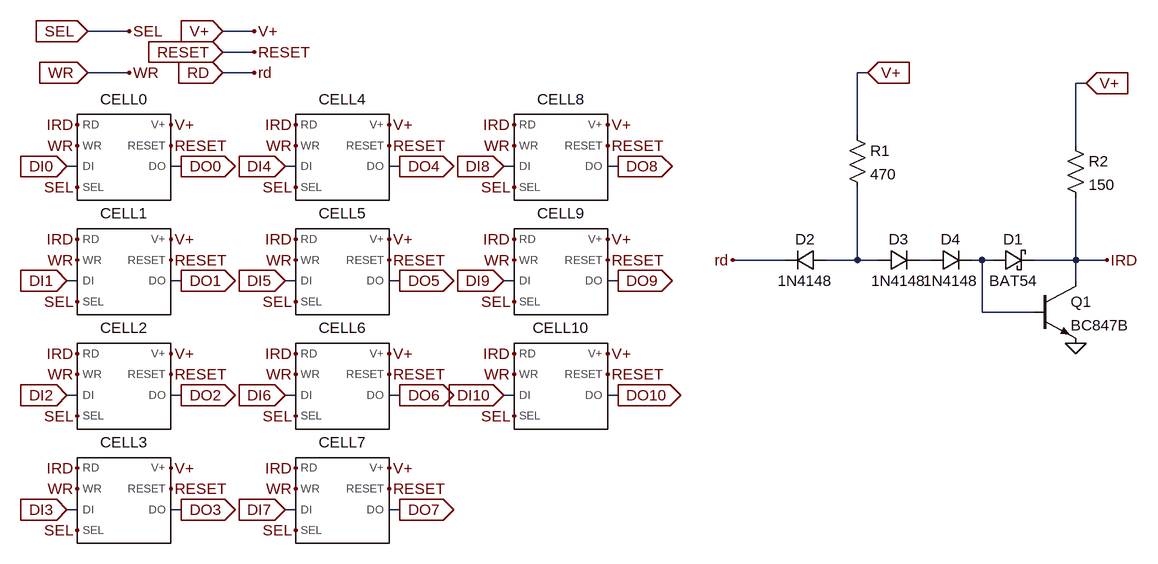
[diagram p0: schematic PMemWord.asc]
PMemWord.asc, the LTspice schematic file:
Version 4
SHEET 1 1744 2248
WIRE 192 80 128 80
WIRE 384 80 336 80
WIRE 384 112 336 112
WIRE 192 144 128 144
WIRE 384 144 336 144
WIRE 1328 144 1312 144
WIRE 1664 160 1648 160
WIRE 1312 240 1312 144
WIRE 1648 256 1648 160
WIRE 112 288 96 288
WIRE 272 288 256 288
WIRE 448 288 432 288
WIRE 608 288 592 288
WIRE 784 288 768 288
WIRE 944 288 928 288
WIRE 1200 432 1120 432
WIRE 1312 432 1312 320
WIRE 1312 432 1264 432
WIRE 1344 432 1312 432
WIRE 1424 432 1408 432
WIRE 1504 432 1488 432
WIRE 1520 432 1504 432
WIRE 1648 432 1648 336
WIRE 1648 432 1584 432
WIRE 1696 432 1648 432
WIRE 112 464 96 464
WIRE 272 464 256 464
WIRE 448 464 432 464
WIRE 608 464 592 464
WIRE 784 464 768 464
WIRE 944 464 928 464
WIRE 1648 464 1648 432
WIRE 1504 512 1504 432
WIRE 1584 512 1504 512
WIRE 112 640 96 640
WIRE 272 640 256 640
WIRE 448 640 432 640
WIRE 608 640 592 640
WIRE 784 640 768 640
WIRE 944 640 928 640
WIRE 112 816 96 816
WIRE 272 816 256 816
WIRE 448 816 432 816
WIRE 608 816 592 816
FLAG 256 224 V+
FLAG 256 256 RESET
FLAG 96 288 DI0
IOPIN 96 288 In
FLAG 272 288 DO0
IOPIN 272 288 Out
FLAG 112 224 IRD
FLAG 112 256 WR
FLAG 112 320 SEL
FLAG 128 80 SEL
IOPIN 128 80 In
FLAG 192 80 SEL
FLAG 336 144 RD
IOPIN 336 144 In
FLAG 128 144 WR
IOPIN 128 144 In
FLAG 192 144 WR
FLAG 336 80 V+
IOPIN 336 80 In
FLAG 384 80 V+
FLAG 336 112 RESET
IOPIN 336 112 In
FLAG 384 112 RESET
FLAG 256 400 V+
FLAG 256 432 RESET
FLAG 96 464 DI1
IOPIN 96 464 In
FLAG 272 464 DO1
IOPIN 272 464 Out
FLAG 112 400 IRD
FLAG 112 432 WR
FLAG 112 496 SEL
FLAG 256 576 V+
FLAG 256 608 RESET
FLAG 96 640 DI2
IOPIN 96 640 In
FLAG 272 640 DO2
IOPIN 272 640 Out
FLAG 112 576 IRD
FLAG 112 608 WR
FLAG 112 672 SEL
FLAG 256 752 V+
FLAG 256 784 RESET
FLAG 96 816 DI3
IOPIN 96 816 In
FLAG 272 816 DO3
IOPIN 272 816 Out
FLAG 112 752 IRD
FLAG 112 784 WR
FLAG 112 848 SEL
FLAG 592 224 V+
FLAG 592 256 RESET
FLAG 432 288 DI4
IOPIN 432 288 In
FLAG 608 288 DO4
IOPIN 608 288 Out
FLAG 448 224 IRD
FLAG 448 256 WR
FLAG 448 320 SEL
FLAG 592 400 V+
FLAG 592 432 RESET
FLAG 432 464 DI5
IOPIN 432 464 In
FLAG 608 464 DO5
IOPIN 608 464 Out
FLAG 448 400 IRD
FLAG 448 432 WR
FLAG 448 496 SEL
FLAG 592 576 V+
FLAG 592 608 RESET
FLAG 432 640 DI6
IOPIN 432 640 In
FLAG 608 640 DO6
IOPIN 608 640 Out
FLAG 448 576 IRD
FLAG 448 608 WR
FLAG 448 672 SEL
FLAG 592 752 V+
FLAG 592 784 RESET
FLAG 432 816 DI7
IOPIN 432 816 In
FLAG 608 816 DO7
IOPIN 608 816 Out
FLAG 448 752 IRD
FLAG 448 784 WR
FLAG 448 848 SEL
FLAG 928 224 V+
FLAG 928 256 RESET
FLAG 768 288 DI8
IOPIN 768 288 In
FLAG 944 288 DO8
IOPIN 944 288 Out
FLAG 784 224 IRD
FLAG 784 256 WR
FLAG 784 320 SEL
FLAG 928 400 V+
FLAG 928 432 RESET
FLAG 768 464 DI9
IOPIN 768 464 In
FLAG 944 464 DO9
IOPIN 944 464 Out
FLAG 784 400 IRD
FLAG 784 432 WR
FLAG 784 496 SEL
FLAG 928 576 V+
FLAG 928 608 RESET
FLAG 768 640 DI10
IOPIN 768 640 In
FLAG 944 640 DO10
IOPIN 944 640 Out
FLAG 784 576 IRD
FLAG 784 608 WR
FLAG 784 672 SEL
FLAG 1648 560 0
FLAG 1328 144 V+
IOPIN 1328 144 In
FLAG 1664 160 V+
IOPIN 1664 160 In
FLAG 1696 432 IRD
FLAG 384 144 rd
FLAG 1120 432 rd
SYMBOL PMemCell 176 272 R0
SYMATTR InstName CELL0
SYMBOL PMemCell 176 448 R0
SYMATTR InstName CELL1
SYMBOL PMemCell 176 624 R0
SYMATTR InstName CELL2
SYMBOL PMemCell 176 800 R0
SYMATTR InstName CELL3
SYMBOL PMemCell 512 272 R0
SYMATTR InstName CELL4
SYMBOL PMemCell 512 448 R0
SYMATTR InstName CELL5
SYMBOL PMemCell 512 624 R0
SYMATTR InstName CELL6
SYMBOL PMemCell 512 800 R0
SYMATTR InstName CELL7
SYMBOL PMemCell 848 272 R0
SYMATTR InstName CELL8
SYMBOL PMemCell 848 448 R0
SYMATTR InstName CELL9
SYMBOL PMemCell 848 624 R0
SYMATTR InstName CELL10
SYMBOL npn 1584 464 R0
SYMATTR InstName Q1
SYMATTR Value BC847B
SYMBOL schottky 1520 448 R270
WINDOW 0 32 32 VTop 2
WINDOW 3 0 32 VBottom 2
SYMATTR InstName D1
SYMATTR Value BAT54
SYMATTR Description Diode
SYMATTR Type diode
SYMBOL diode 1264 448 M270
WINDOW 0 32 32 VTop 2
WINDOW 3 0 32 VBottom 2
SYMATTR InstName D2
SYMATTR Value 1N4148
SYMBOL res 1296 224 R0
SYMATTR InstName R1
SYMATTR Value 470
SYMBOL diode 1344 416 M90
WINDOW 0 0 32 VBottom 2
WINDOW 3 32 32 VTop 2
SYMATTR InstName D3
SYMATTR Value 1N4148
SYMBOL diode 1424 416 M90
WINDOW 0 0 32 VBottom 2
WINDOW 3 32 32 VTop 2
SYMATTR InstName D4
SYMATTR Value 1N4148
SYMBOL res 1632 240 R0
SYMATTR InstName R2
SYMATTR Value 150

The netlist it stands for:
* PMemWord.asc
XCELL0 IRD RESET DI0 V+ DO0 WR SEL PMemCell  ; pins RD RESET DI V+ DO WR SEL
XCELL1 IRD RESET DI1 V+ DO1 WR SEL PMemCell  ; pins RD RESET DI V+ DO WR SEL
XCELL2 IRD RESET DI2 V+ DO2 WR SEL PMemCell  ; pins RD RESET DI V+ DO WR SEL
XCELL3 IRD RESET DI3 V+ DO3 WR SEL PMemCell  ; pins RD RESET DI V+ DO WR SEL
XCELL4 IRD RESET DI4 V+ DO4 WR SEL PMemCell  ; pins RD RESET DI V+ DO WR SEL
XCELL5 IRD RESET DI5 V+ DO5 WR SEL PMemCell  ; pins RD RESET DI V+ DO WR SEL
XCELL6 IRD RESET DI6 V+ DO6 WR SEL PMemCell  ; pins RD RESET DI V+ DO WR SEL
XCELL7 IRD RESET DI7 V+ DO7 WR SEL PMemCell  ; pins RD RESET DI V+ DO WR SEL
XCELL8 IRD RESET DI8 V+ DO8 WR SEL PMemCell  ; pins RD RESET DI V+ DO WR SEL
XCELL9 IRD RESET DI9 V+ DO9 WR SEL PMemCell  ; pins RD RESET DI V+ DO WR SEL
XCELL10 IRD RESET DI10 V+ DO10 WR SEL PMemCell  ; pins RD RESET DI V+ DO WR SEL
Q1 IRD N003 0 0 BC847B
D1 N003 IRD BAT54
D2 N001 RD 1N4148
R1 V+ N001 470
D3 N001 N002 1N4148
D4 N002 N003 1N4148
R2 V+ IRD 150
.model D D
.lib standard.dio
.model NPN NPN
.model PNP PNP
.lib standard.bjt
.backanno
.end